# Altium schematic sheet BlockDiagram.SchDoc
size A3; SheetNumber: 2; SheetTotal: 11
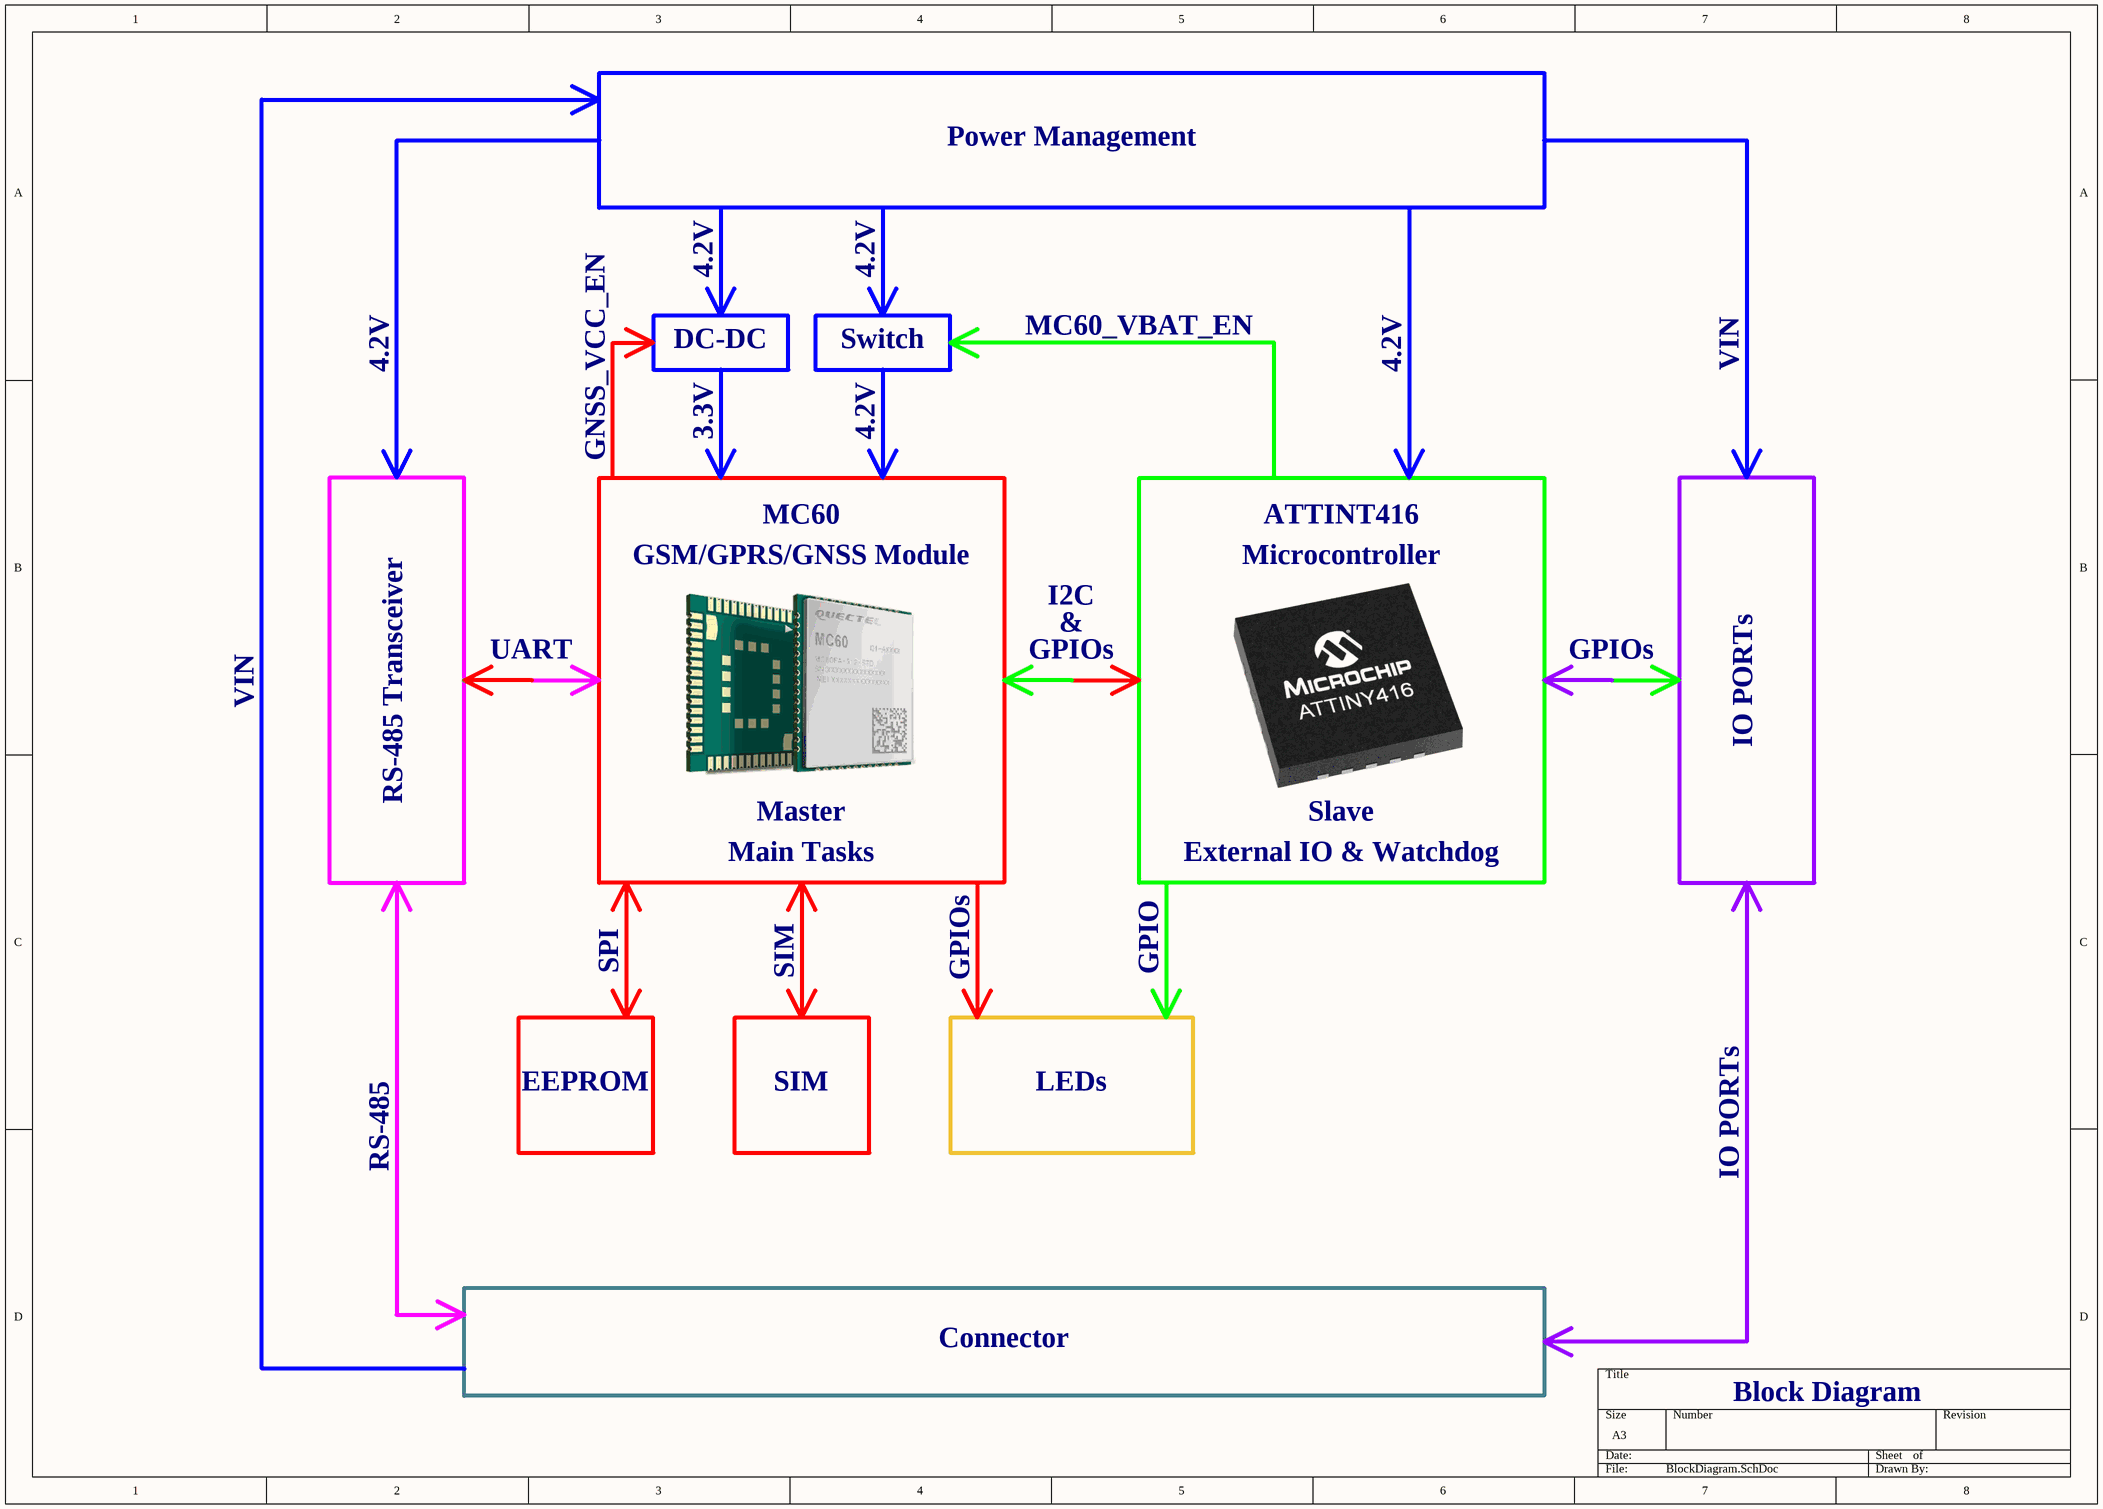
[diagram p0: BlockDiagram.SchDoc]

## Notes on the sheet
- Power Management
- 4.2V
- GNSS_VCC_EN
- DC-DC
- Switch
- MC60_VBAT_EN
- VIN
- 3.3V
- MC60
- GSM/GPRS/GNSS Module
- ATTINT416
- Microcontroller
- &
- I2C
- RS-485 Transceiver
- UART
- GPIOs
- IO PORTs
- Master
- Slave
- Main Tasks
- External IO & Watchdog
- SPI
- SIM
- GPIO
- RS-485
- EEPROM
- LEDs
- Connector
- Block Diagram